# Altium schematic sheet Power_Management.SchDoc
size A3; SheetNumber: 2; SheetTotal: 5
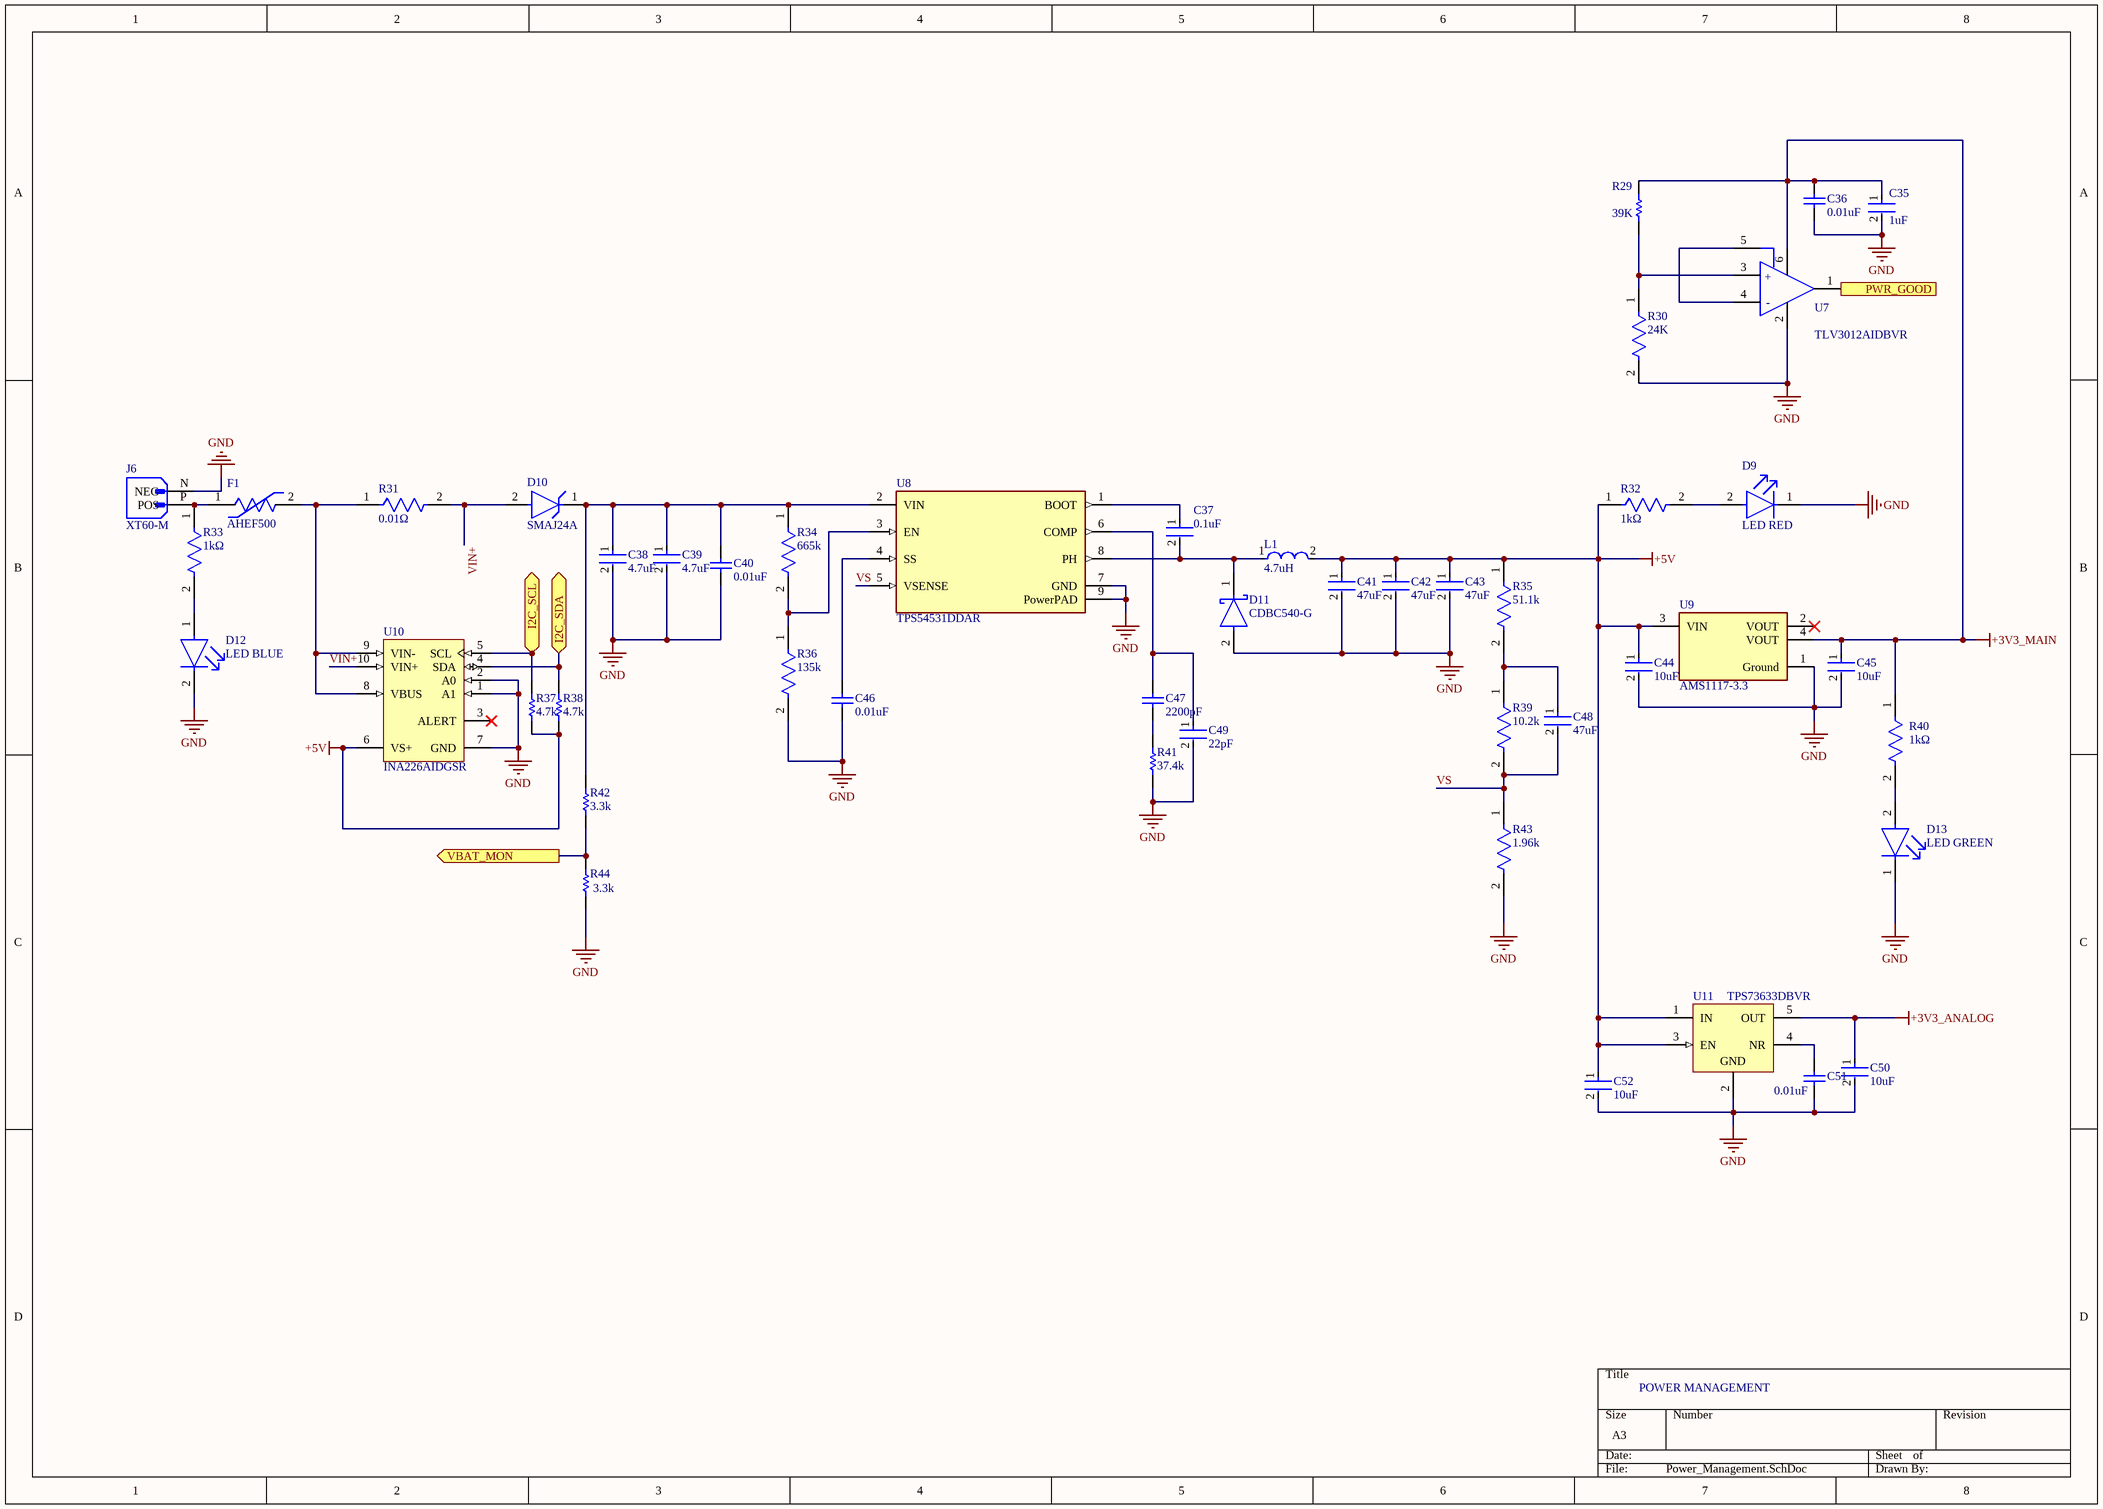
[diagram p0: Power_Management.SchDoc]

## Parts
C35  1uF  [FP-GCJ21B-0_3-IPC_B]
C36  0.01uF  [CAPC1608X87X35NL15T15]
C37  0.1uF  [FP-0805B-IPC_C]
C38  4.7uF  [FP-CC0603-DA-MFG]
C39  4.7uF  [FP-CC0603-DA-MFG]
C40  0.01uF  [CAPC1608X87X35NL15T15]
C41  47uF  [FP-0603-L_1_6_0_2-W_0_8_0-MFG]
C42  47uF  [FP-0603-L_1_6_0_2-W_0_8_0-MFG]
C43  47uF  [FP-0603-L_1_6_0_2-W_0_8_0-MFG]
C44  10uF  [FP-C0603C106M8PACTU-MFG]
C45  10uF  [FP-C0603C106M8PACTU-MFG]
C46  0.01uF  [CAPC1608X87X35NL15T15]
C47  2200pF  [CAPC1608X90X35NL15T15]
C48  47uF  [FP-0603-L_1_6_0_2-W_0_8_0-MFG]
C49  22pF  [FP-C0603C-CF-MFG]
C50  10uF  [FP-C0805C106K8RACAUTO-MFG]
C51  0.01uF  [CAPC1608X87X35NL15T15]
C52  10uF  [FP-C0805C106K8RACAUTO-MFG]
D9  LED RED  [FP-SML-LXT0805IW-TR-MFG]
D10  SMAJ24A  [FP-SMAJ-MFG]
D11  CDBC540-G  [FP-DO-214AB_SMC-MFG]
D12  LED BLUE  [FP-SM0805UBWC-MFG]
D13  LED GREEN  [FP-LTST-C171GKT-MFG]
F1  AHEF500  [FP-AHEF500-MFG]
J6  XT60-M  [AMASS_XT60-M]
L1  4.7uH  [FP-MLZ1608-IPC_A]
R29  39K  [RESC0603(1608)_L]
R30  24K  [FP-CRCW0603-Pe3-MFG]
R31  0.01Ω  [FP-GMR320-MFG]
R32  1kΩ  [FP-RNCF0603-MFG]
R33  1kΩ  [FP-RNCF0603-MFG]
R34  665k  [FP-CRCW0603-HPe3-IPC_B]
R35  51.1k  [FP-CRCW0603-e3-IPC_B]
R36  135k  [FP-CRCW0603-e3-IPC_C]
R37  4.7k  [RESC3225X75X50ML15T25]
R38  4.7k  [RESC3225X75X50ML15T25]
R39  10.2k  [FP-AC0603-IPC_B]
R40  1kΩ  [FP-RNCF0603-MFG]
R41  37.4k  [RESC1608X55X25NL10T15]
R42  3.3k  [RESC1812(4532)_L]
R43  1.96k  [FP-CRCW0603-HPe3-IPC_B]
R44  3.3k  [RESC2512(6432)_M]
U7  TLV3012AIDBVR  [FP-DBV0006A-IPC_B]
U8  TPS54531DDAR  [FP-DDA0008E-MFG]
U9  AMS1117-3.3  [FP-AMS1117-IPC_C]
U10  INA226AIDGSR  [DGS0010A_L]
U11  TPS73633DBVR  [DBV0005A_L]

## Ports
I2C_SCL (bidir, see EMP_FC_Main[2C], MCU_Core[7A]), I2C_SDA (bidir, see EMP_FC_Main[2C], MCU_Core[7A]), PWR_GOOD (out, see EMP_FC_Main[2C], MCU_Core[3B]), VBAT_MON (out, see EMP_FC_Main[2B], MCU_Core[3B])

## Nets
+3V3_ANALOG: C50.1 U11.5(OUT)
+3V3_MAIN: C35.1 C36.2 C45.1 R29.2 R40.1 U7.6(V+) U9.4(VOUT)
+5V: C41.1 C42.1 C43.1 C44.1 C52.1 L1.2 R32.1 R35.1 R37.1 R38.1 U9.3(VIN) U10.6(VS+) U11.1(IN) U11.3(EN)
GND: C35.2 C36.1 C38.2 C39.2 C40.1 C41.2 C42.2 C43.2 C44.2 C45.2 C46.1 C49.2 C50.2 C51.1 C52.2 D9.1(C) D11.2(A) D12.2(C) D13.1(C) J6.N(NEG) R30.2 R36.2 R41.1 R43.2 R44.1 U7.2(V-) U8.7(GND) U8.9(PowerPAD) U9.1(Ground) U10.1(A1) U10.2(A0) U10.7(GND) U11.2(GND)
I2C_SCL: R37.2 U10.5(SCL) ; port I2C_SCL
I2C_SDA: R38.2 U10.4(SDA) ; port I2C_SDA
PWR_GOOD: U7.1(OUT) ; port PWR_GOOD
VBAT_MON: R42.1 R44.2 ; port VBAT_MON
VIN+: D10.2(A) R31.2 U10.10(VIN+)
VS: C48.2 R39.2 R43.1 U8.5(VSENSE)
NetC37_1: C37.1 U8.1(BOOT)
NetC37_2: C37.2 D11.1(C) L1.1 U8.8(PH)
NetC38_1: C38.1 C39.1 C40.2 D10.1(C) R34.1 R42.2 U8.2(VIN)
NetC46_2: C46.2 U8.4(SS)
NetC47_1: C47.1 R41.2
NetC47_2: C47.2 C49.1 U8.6(COMP)
NetC48_1: C48.1 R35.2 R39.1
NetC51_2: C51.2 U11.4(NR)
NetD9_2: D9.2(A) R32.2
NetD12_1: D12.1(A) R33.2
NetD13_2: D13.2(A) R40.2
NetF1_1: F1.1 J6.P(POS) R33.1
NetF1_2: F1.2 R31.1 U10.8(VBUS) U10.9(VIN-)
NetR29_1: R29.1 R30.1 U7.3(IN+)
NetR34_2: R34.2 R36.1 U8.3(EN)
NetU7_4: U7.4(IN-) U7.5(REF)

Not connected (* = marked no-connect by the designer): U9 2(VOUT)*; U10 3(ALERT)*

## Notes on the sheet
- POWER MANAGEMENT
- (in symbol CMP-04896-000075-1) +

## Library data of the parts
C35 = CMP-06035-032003-1: Multilayer Ceramic Capacitors MLCC - SMD/SMT 0805 1uF 10%, 16VDC,  X8L +15/-40%
C36 C40 C46 C51 = CMP-2006-03841-1: Part Number: C0603S103J5RACTU; Manufacturer: Kemet
C37 = CMP-45632-000003-1: CAP CER 0.1UF 50V X7R 0805; Capacitance: 100nF; Tolerance: 10%; RoHS Compliant: Yes; Packaging: Tape and Reel; Voltage Rating (DC): 50V; Voltage Rating: 50V; Length: 2mm; Lead Free: Lead Free; Voltage: 50V; Case/Package: 0805; Case Code (Metric): 2012; Depth: 1.25mm; Min Operating Temperature: -55°C; Case Code (Imperial): 0805; Max Operating Temperature: 125°C; Radiation Hardening: No; Dielectric: X7R
C38 C39 = CMP-03422-001217-1: CAP CER 4.7UF 25V X5R 0603; Manufacturer: YAGEO; Manufacturer Part Number: CC0603KRX5R8BB475; Material: Ceramic; Temperature Coefficient: 15%; Tolerance: 0.1; Device Class L1: Passive Components; Temperature: -55°C to +125°C; Value: 4.7 uF; RoHS: TRUE; Temperature Range High: +125°C; Automotive: No; Lead Free: Yes; Digikey Description: CAP CER 4.7UF 25V X5R 0603; Category: Cap; Temperature Characteristic: X5R; Package: CC0603-DA; Device Class L2: Capacitors; Temperature Range Low: -55°C; Voltage Rating: 25 V; Capacitance: 4.7 uF; ComponentLink2URL: http://www.yageo.com/documents/recent/UPY-GPHC_X7R_6.3V-to-50V_18.pdf; Octopart: https://octopart.com/cc0603krx5r8bb475-yageo-77825350; Footprint Url: http://www.yageo.com/exep/pages/download/literatures/UPY-C_GEN_24.pdf; Device Class L3: Ceramic Capacitors; ComponentLink2Description: Datasheet; Voltage: 25 V; Height: 0.9mm
C41-C43 C48 = CMP-14477-005318-1: Multilayer Ceramic Capacitor 47uF 4V X6S 20% SMD 0603 T/R
C44 C45 = CMP-03020-034654-1: CAP CER 10UF 10V X5R 0603; RoHS Compliant: Yes
C47 = CMP-2006-04411-1: Manufacturer: AVX Interconnect / Elco; Part Number: 06035C222KAZ2A
C49 = CMP-03020-026027-1: CAP CER 22PF 100V C0G/NP0 0603; Manufacturer: KEMET; Manufacturer Part Number: C0603C220J1GACAUTO; Material: Ceramic; Temperature Coefficient: 30ppm/°C; Temperature Characteristic: C0G; Automotive Grade: Grade 1; Tolerance: 0.05; Value: 22 pF; Device Class L2: Capacitors; Digikey Description: CAP CER 22PF 100V C0G/NP0 0603; Device Class L3: Ceramic Capacitors; Package: C0603C-CF; Temperature Range Low: -55°C; Automotive: Yes; Voltage Rating: 100 V; Category: Cap; Temperature Range High: +125°C; Lead Free: Yes; RoHS: TRUE; Temperature: -55°C to +125°C; ComponentLink2Description: Datasheet; ComponentLink2URL: https://api.kemet.com/component-edge/download/datasheet/C0603C100J5GACAUTO.pdf; Mouser Description: Cap Ceramic 22pF 100V C0G 5% SMD 0603 125°C Paper T/R; Octopart: https://octopart.com/c0603c220j1gacauto-kemet-75613140; Capacitance: 22 pF; Device Class L1: Passive Components; Height: 0.87mm
C50 C52 = CMP-03020-034662-1: CAP CER 10UF 10V X7R 0805; Tolerance: 10%; Case/Package: 0805; Ratings: AEC-Q200; Packaging: Tape and Reel; Voltage Rating: 10V; Max Operating Temperature: 125°C; Min Operating Temperature: -55°C; Case Code (Metric): 2012; Case Code (Imperial): 0805; Mount: Surface Mount; RoHS Compliant: Yes; Capacitance: 10uF
D9 = CMP-1724-00002-2: LED RED DIFFUSED SMD; Lens Style: Rectangular; Luminous Intensity: 11mcd; Approvals: UL; Test Current: 20mA; Forward Voltage: 2V; Number of LEDs: 1; Wavelength: 635nm; Lens Color: White; Viewing Angle: 140°; Min Operating Temperature: -25°C; Case Code (Metric): 2012; Mount: Surface Mount; Case Code (Imperial): 0805; Height: 0.8mm; Lead Free: Lead Free; Color: Red; Package Quantity: 1; Illumination Color: Red; Lens Transparency: Diffused; Forward Current: 20mA; Packaging: Tape and Reel; Length: 2mm; Case/Package: 0805; REACH SVHC: No SVHC; Width: 1.25mm; Number of Pins: 2; Max Operating Temperature: 80°C; Dominant Wavelength: 635nm
D10 = CMP-08607-000085-1: TVS DIODE 24V 38.9V DO214AC; Manufacturer: Littelfuse Inc; Direction: Unidirectional; Peak Pulse Power: 400W; Peak Pulse Current: 10.3A; Max Junction Temp: +150°C; Breakdown Voltage: 26.7V; Number Of Channels: 1; ComponentLink2Description: Datasheet; Device Class L3: unset; Height: 2.29mm; ComponentLink2URL: https://www.littelfuse.com/~/media/electronics/datasheets/tvs_diodes/littelfuse_tvs_diode_smaj_datasheet.pdf.pdf; Device Class L1: Circuit Protection; Package: SMAJ; Temperature Range High: +150°C; Device Class L2: TVS Diodes; Clamping Voltage: 38.9V; Reverse Standoff Voltage: 24V; Manufacturer Part Number: SMAJ24A; Mouser Description: In a Pack of 25, Littelfuse SMAJ24A, Uni-Directional TVS Diode, 400W, 2-Pin DO-214AC; Digikey Description: TVS DIODE 24V 38.9V DO214AC; Lead Free: Yes; Octopart: https://octopart.com/smaj24a-littelfuse-350003; Automotive: No; Temperature Range Low: -65°C; Category: Diode; RoHS: TRUE; Temperature: -65°C to +150°C
D11 = CMP-20227-000004-1: DIODE SCHOTTKY 40V 5A DO214AB; Max Surge Current: 100A; Max Reverse Leakage Current: 500uA; Number of Pins: 2; Packaging: Tape and Reel; Max Reverse Voltage (DC): 40V; Package Quantity: 1; Average Rectified Current: 5A; Mount: Surface Mount
D12 = CMP-35283-000004-1: LED BLUE CLEAR 0805 SMD; Dominant Wavelength: 470nm; Forward Voltage: 3.3V; Forward Current: 20mA; Lens Color: Colorless; Lens Style: Rectangular; Luminous Intensity: 115mcd; Viewing Angle: 130°; Power Rating: 100mW; Lens Transparency: Clear; Height: 1.1mm; Mount: Surface Mount; Packaging: Tape and Reel; Package Quantity: 3000; Illumination Color: Blue; Width: 1.2mm; Min Operating Temperature: -30°C; Case Code (Imperial): 0805; Length: 2mm; Test Current: 20mA; Max Operating Temperature: 80°C; Case Code (Metric): 2012; Color: Blue; Wavelength: 470nm; Case/Package: 0805; Lead Free: Lead Free; Number of Pins: 2
D13 = CMP-22017-000007-1: LED GREEN CLEAR CHIP SMD; Luminous Intensity: 12mcd; Lens Color: Colorless; Dominant Wavelength: 569nm; Number of LEDs: 1; Power Dissipation: 100mW; Viewing Angle: 130°; Reverse Voltage: 5V; Test Current: 10mA; Forward Voltage: 2.1V; Wavelength: 585nm; Lens Style: Diffused; Forward Current: 30mA; Height: 0.8mm; Mount: Surface Mount; Package Quantity: 1; Length: 2mm; Case Code (Metric): 2012; Number of Pins: 2; Number of Elements: 1; Packaging: Tape and Reel; Color: Green; Min Operating Temperature: -55°C; Case/Package: 0805; Power Rating: 100mW; Max Operating Temperature: 85°C; Radiation Hardening: No; Depth: 1.25mm; Lens Transparency: Clear; Width: 1.25mm; Lead Free: Lead Free; Case Code (Imperial): 0805; Illumination Color: Green
F1 = CMP-08606-000056-1: PTC RESET FUSE 32V 5A RADIAL; Manufacturer: Littelfuse Inc.; Trip Current: 10A; Current Rating: 100A; Trip Time: 9s; Value: 0.015-0.04Ω; Automotive Grade: Grade 1; Temperature: -40°C to +125°C; Device Class L1: Circuit Protection; Height: 24.1mm; ComponentLink2Description: Datasheet; RoHS: TRUE; Temperature Range High: +125°C; Device Class L3: unset; ComponentLink2URL: https://www.littelfuse.com/~/media/electronics/datasheets/resettable_ptcs/littelfuse_ptc_radial_leaded_ahef_datasheet.pdf.pdf; Octopart: https://octopart.com/ahef500-littelfuse-74214520; Mouser Description: PTC Resettable Fuse 5A(hold) 10A(trip) 32VDC 100A 5.3W 9s 0.015Ohm Radial 14 X 3.8 X 24.1mm Bulk Automotive; Voltage Rating: 32V; Package: 0; Ambient Temperature Range Low: -40°C; Manufacturer Part Number: AHEF500; Device Class L2: PTC Resettable Fuses; Category: Fuse; Hold Current: 5A; Automotive: Yes; Ambient Temperature Range High: +125°C; Lead Free: Yes; Digikey Description: PTC RESET FUSE 32V 5A RADIAL; Temperature Range Low: -40°C; Resistance: 0.015-0.04Ω
J6 = XT60-M: Plug; DC supply; XT60; male; PIN: 2; for cable; soldered; 30A; 500V; MF: AMASS; SnapEDA_Link: https://www.snapeda.com/parts/XT60-M/AMASS/view-part/?ref=snap; Package: Package; Value: *; MP: XT60-M; Check_prices: https://www.snapeda.com/parts/XT60-M/AMASS/view-part/?ref=eda
L1 = CMP-08253-000311-1: Shielded Multilayer Inductor 4.7uH ±20% 350mA 650mΩ SMD 0603; DC Resistance (DCR): 650mR; Test Frequency: 2MHz; Self Resonant Frequency: 80MHz; Core Material: Ferrite; Saturation Current: 120mA; Packaging: Tape and Reel; Width: 0.031inch; Height - Seated (Max): 0.037inch; Inductance: 4.7uH; Current Rating: 350mA; Max Operating Temperature: 125°C; Tolerance: 20%; Length: 0.063inch; Package Quantity: 4000; Case/Package: 0603; Case Code (Imperial): 0603; Min Operating Temperature: -55°C; Case Code (Metric): 1608; RoHS Compliant: Yes; Shielding: Shielded; Mount: Surface Mount
R29 = CMP-1012-00112-1: 39K 0.1W 5% 0603 (1608 Metric)  SMD; Case-Metric: 1608; Case-EIA: 0603; Value: 39000.00 Ohm; Technology: SMT; Tolerance: 5 %; Power: 0.1 W
R30 = CMP-03613-000177-1: RES Thick Film, 24kΩ, 0.5%, 0.1W, 50ppm/°C, 0603; Max Power Dissipation: 100mW; Resistance: 24kR; Tolerance: 0.5%; Temperature Coefficient: 50ppm/°C; Package Quantity: 5000; Width: 0.033inch; Length: 0.061inch; Features: Automotive AEC-Q200; Packaging: Tape and Reel; RoHS Compliant: Yes; Series: CRCW-P; Case/Package: 0603; Height: 0.02inch; Max Operating Temperature: 155°C; Resistor Type: Thick Film; Number of Terminations: 2; Min Operating Temperature: -55°C
R31 = CMP-08839-027812-1: RES 10M OHM 1% 10W 2817
R32 R33 R40 = CMP-26527-000463-1: RES 1K OHM, 0.01%, 2 PPM, 0.1W,; RoHS Compliant: Yes
R34 = CMP-02407-005241-1: RES Thick Film, 665kΩ, 1%, 0.33W, 100ppm/°C, 0603; Max Power Dissipation: 250mW; Resistance: 665kR; Max Operating Temperature: 155°C; Tolerance: 1%; Features: Automotive AEC-Q200; Height: 0.022inch; Width: 0.033inch; Package Quantity: 5000; Lead Free: Lead Free; Min Operating Temperature: -55°C; Temperature Coefficient: 100ppm/°C; Packaging: Tape and Reel; Length: 0.063inch; Composition: Thick Film; Case/Package: 0603; Number of Terminations: 2
R35 = CMP-02407-006544-1: RES Thick Film, 511kΩ, 1%, 0.1W, 100ppm/°C, 0603; Resistance: 511kR; Max Power Dissipation: 100mW; Min Operating Temperature: -55°C; Lead Free: Lead Free; Width: 0.033inch; Max Operating Temperature: 155°C; Temperature Coefficient: 100ppm/°C; Packaging: Tape and Reel; Tolerance: 1%; Composition: Thick Film; Features: Automotive AEC-Q200; Case/Package: 0603; Package Quantity: 20000; Length: 0.061inch; Number of Terminations: 2; Height: 0.02inch
R36 = CMP-02407-003653-1: RES Thick Film, 130kΩ, 5%, 0.1W, 200ppm/°C, 0603; Resistance: 130kR; Max Power Dissipation: 100mW; Features: Automotive AEC-Q200; Packaging: Tape and Reel; Temperature Coefficient: 200ppm/°C; Number of Terminations: 2; Width: 0.033inch; Composition: Thick Film; Min Operating Temperature: -55°C; Length: 0.061inch; Max Operating Temperature: 155°C; Height: 0.02inch; Lead Free: Lead Free; Case/Package: 0603; Tolerance: 5%; Package Quantity: 20000
R37 R38 = CMP-2005-00861-1: Manufacturer: Vishay Dale; Part Number: TNPW12104K70BETA
R39 = CMP-03412-037842-1: RES 2kΩ 1.00% 0.1W 0603; Resistance: 2kR; Tolerance: 1%; RoHS Compliant: Yes; Case/Package: 0603
R41 = CMP-2000-04027-1: Part Number: RC0603FR-07374KL; Manufacturer: Yageo
R42 = CMP-1016-00602-1: 10K 0.75W 1% 1812 (4532 Metric)  SMD; Case-EIA: 1812; Case-Metric: 4532; Value: 10000.00 Ohm; Technology: SMT; Power: 0.75 W; Tolerance: 1 %
R43 = CMP-02407-003606-1: RES Thick Film, 1.96kΩ, 1%, 0.33W, 100ppm/°C, 0603; Resistance: 1.96kR; Max Power Dissipation: 250mW; Features: Automotive AEC-Q200; Packaging: Tape and Reel; Length: 0.063inch; Max Operating Temperature: 155°C; Tolerance: 1%; Temperature Coefficient: 100ppm/°C; Min Operating Temperature: -55°C; Case/Package: 0603; Composition: Thick Film; Number of Terminations: 2; Width: 0.033inch; Package Quantity: 5000; Lead Free: Lead Free; Height: 0.022inch
R44 = CMP-1018-00567-1: 3K3 1W 1% 2512 (6432 Metric)  SMD; Value: 3300.00 Ohm; Case-Metric: 6432; Case-EIA: 2512; Tolerance: 1 %; Power: 1 W; Technology: SMT
U7 = CMP-04896-000075-1: IC COMPARATOR 1.8V W/REF SOT23-6; Max Supply Current: 5uA; Max Input Current: 10pA; Number of Elements: 1; Response Time: 6us; Propagation Delay: 13.5us; Max Supply Voltage: 5.5V; Input Offset Voltage (Vos): 12mV; Output Current: 500uA; Power Supply Rejection Ratio (PSRR): 80dB; Common Mode Rejection Ratio: 74dB; Output Type: PUSH-PULL; Max Operating Temperature: 85°C; REACH SVHC: No SVHC; Mount: Surface Mount; Case/Package: SOT-23-6; Min Operating Temperature: -40°C; Min Supply Voltage: 1.8V; Number of Channels: 1; Series: -; Packaging: Tape and Reel; Input Bias Current: 10pA; Lead Free: Lead Free; Number of Pins: 6; Package Quantity: 3000; Nominal Supply Current: 5uA; Radiation Hardening: No; RoHS Compliant: Yes; Contact Plating: Gold; Supply Current: 5uA; Quiescent Current: 5uA
U8 = CMP-04918-000157-1: IC REG BUCK ADJUSTABLE 5A 8SOPWR; Switching Frequency: 570kHz; Output Configuration: Positive; Min Supply Voltage: 3.5V; Output Voltage: 25V; Max Input Voltage: 28V; Number of Outputs: 1; Min Output Voltage: 800mV; Max Output Voltage: 26.04V; Synchronous Rectifier: No; Quiescent Current: 110uA; Case/Package: SOIC; Number of Pins: 8; Package Quantity: 2500; Mount: Surface Mount; REACH SVHC: No SVHC; Min Operating Temperature: -40°C; Max Operating Temperature: 85°C; Max Output Current: 5A; Packaging: Tape and Reel; Lead Free: Lead Free; Output Type: Adjustable; Radiation Hardening: No; Output Current: 5A; Min Input Voltage: 3.5V; Operating Supply Voltage: 28V
U9 = CMP-209535-000001-1: LDO Voltage Regulators 1A, 3.3V; Manufacturer: Advanced Monolithic Systems; Dropout Voltage: 1.1V; Output Type: Fixed; Nominal Supply Current: 5mA; Max Power Dissipation: 1.2W; Max Supply Voltage: 15V; Number Of Outputs: 1; Standoff Height: 0.64mm; Max Junction Temp: +125°C; Height: 1.8mm; Package: AMS1117; Device Class L2: Power Management ICs; ComponentLink2Description: Datasheet; ComponentLink2URL: http://www.advanced-monolithic.com/pdf/ds1117.pdf; Category: IC; RoHS: TRUE; Automotive: No; Device Class L1: Integrated Circuits (ICs); Output Current: 1A; Device Class L3: Voltage Regulators - Linear; Temperature: -40°C to +125°C; Output Voltage: 3.3V; Manufacturer Part Number: AMS1117-3.3; Temperature Range Low: -40°C; Octopart: https://octopart.com/ams1117-3.3-advanced+monolithic+systems-25899300; Lead Free: Yes; Ipc Land Pattern Name: SOT229P700X180-4; Temperature Range High: +125°C
U10 = CMP-0704-00058-2: High-Side Measurement, Bi-Directional Current / Power Monitor with I2C Interface, 2.7 to 5.5 V, -40 to 125 degC, 10-pin SOP (DGS10), Green (RoHS & no Sb/Br); Vs(Max)(V): 5.5; CMRR(Min)(dB): 126; Rating: Catalog; Input Offset (+/-)(Max)(uV): 10; Small-Signal Bandwidth(Typ)(MHz): 0.007; Input Offset Drift (+/-)(Max)(uV/Degrees Celsius): 0.1; Common Mode Range(Max)(V): 36; Gain(V/V): 1; SubFamily: Current Shunt Monitor; Quiescent Current (+/-)(Typ)(mA): 0.33; Vs(Min)(V): 2.7; Common Mode Range(Min)(V): 0; ComponentLink2URL: http://www.ti.com/general/docs/lit/getliterature.tsp?genericPartNumber=INA226&fileType=pdf; ComponentLink1URL: http://www.ti.com/; PartNumber: INA226AIDGSR; Mounting Technology: Surface Mount; PackageDescription: 10-Pin Plastic Small Outline, Body 3 x 3 mm, Pitch 0.5 mm; ComponentLink3Description: Package Specification; Code_JEDEC: MO-153; Eco-Plan: Green (RoHS & no Sb/Br); PackageReference: DGS0010A; ComponentLink2Description: Datasheet; ComponentLink3URL: http://www.ti.com/lit/ml/mpds035b/mpds035b.pdf; ComponentLink1Description: Manufacturer URL; DatasheetVersion: SBOS547; PackageVersion: 4073272/C, 02/2004
U11 = CMP-0395-00256-2: Single Output Low Noise LDO, 400 mA, Fixed 3.3 V Output, 1.7 to 5.5 V Input, with Reverse Current Protection, 5-pin SOT-23 (DBV), -40 to 85 degC, Green (RoHS & no Sb/Br); Manufacturer: Texas Instruments; Vin(Min)(V): 1.7; Vdo(Typ)(mV): 75; Iq(Typ)(mA): 0.3; SubFamily: Single Channel LDO; Vout Adj(Max)(V): 3.3; Accuracy(%): 1; Vin(Max)(V): 5.5; Iout(Max)(A): 0.4; Rating: Catalog; ComponentLink1Description: Manufacturer URL; PartNumber: TPS73633DBVR; PackageDescription: 5-Pin Plastic Small Outline, Body 1.60 Ãƒâ€” 2.90 mm, Pitch 0.95 mm; ComponentLink3URL: http://www.ti.com/litv/pdf/mpds018i; ComponentLink2Description: Datasheet; ComponentLink4Description: URL Link1; DatasheetVersion: SBVS038T; Vout Adj(Min)(V): 3.3; Code_JEDEC: MO-178; Fixed Output Options(V): 3.3; Eco-Plan: Green (RoHS & no Sb/Br); PackageReference: DBV0005A; ComponentLink4URL: Samples URL:http://www.ti.com/product/tps73633#samples; PackageVersion: 4073253-4/K; ComponentLink2URL: http://www.ti.com/general/docs/lit/getliterature.tsp?genericPartNumber=TPS73633&fileType=pdf; ComponentLink1URL: http://www.ti.com/; ComponentLink3Description: Package Specification; Mounting Technology: Surface Mount